# Altium schematic sheet Motors.SchDoc
size B; SheetNumber: 4; SheetTotal: 8
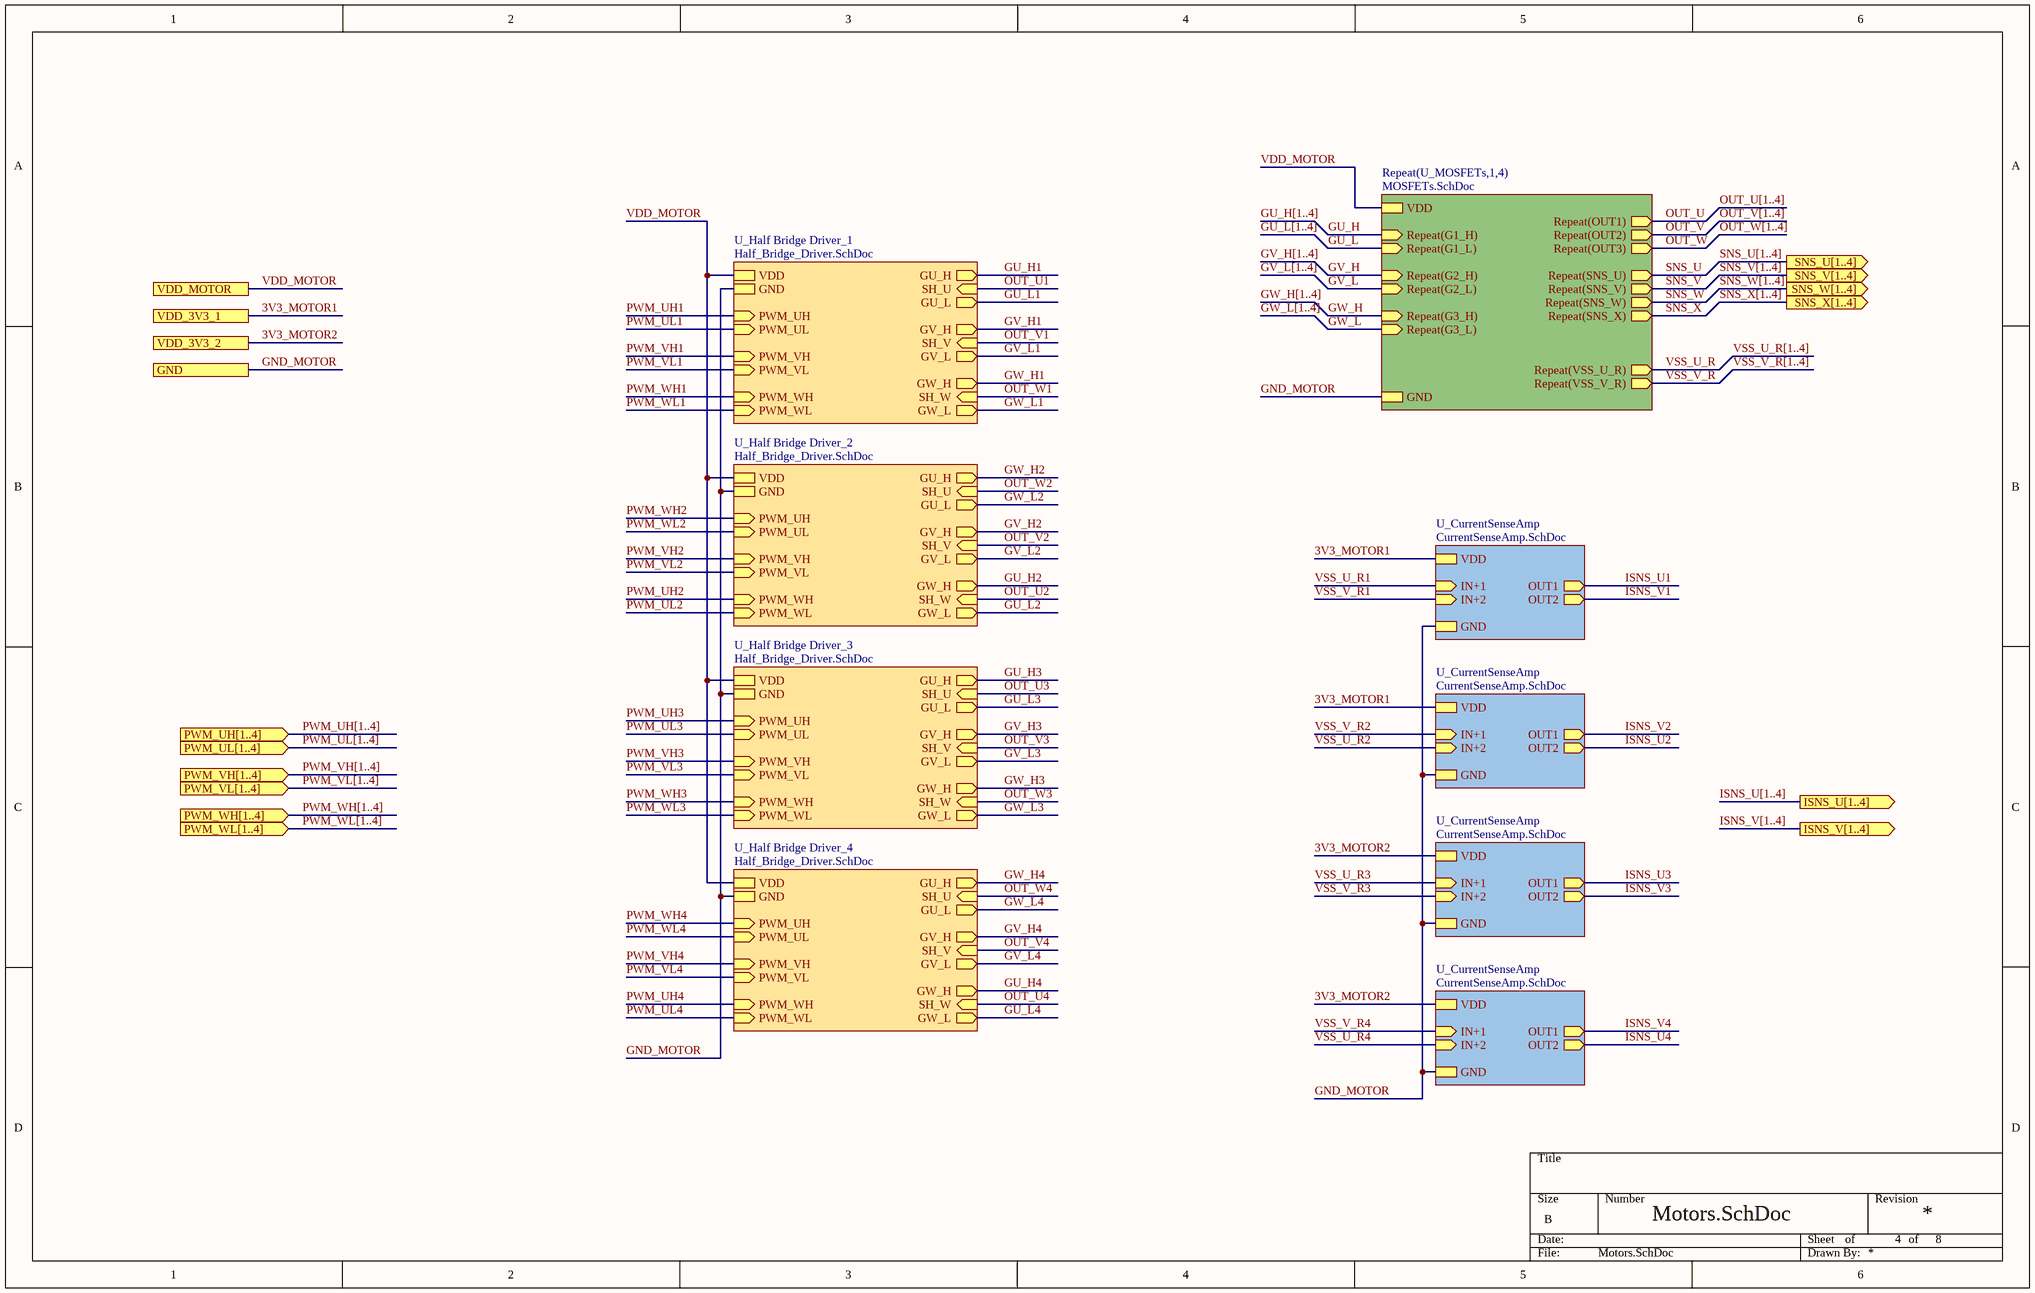
[diagram p0: Motors.SchDoc]

## Sub-sheets
Repeat(U_MOSFETs,1,4) = MOSFETs.SchDoc: Repeat(G2_H) (in), Repeat(G2_L) (in), Repeat(G1_L) (in), Repeat(G1_H) (in), Repeat(G3_H) (in), Repeat(G3_L) (in), Repeat(OUT1) (out), Repeat(OUT2) (out), Repeat(OUT3) (out), VDD, GND, Repeat(SNS_U) (out), Repeat(SNS_V) (out), Repeat(SNS_W) (out), Repeat(SNS_X) (out), Repeat(VSS_U_R) (out), Repeat(VSS_V_R) (out)
U_CurrentSenseAmp = CurrentSenseAmp.SchDoc: VDD, GND, IN+1 (in), IN+2 (in), OUT1 (out), OUT2 (out)
U_CurrentSenseAmp = CurrentSenseAmp.SchDoc: VDD, GND, IN+1 (in), IN+2 (in), OUT1 (out), OUT2 (out)
U_CurrentSenseAmp = CurrentSenseAmp.SchDoc: VDD, GND, IN+1 (in), IN+2 (in), OUT1 (out), OUT2 (out)
U_CurrentSenseAmp = CurrentSenseAmp.SchDoc: VDD, GND, IN+1 (in), IN+2 (in), OUT1 (out), OUT2 (out)
U_Half Bridge Driver_1 = Half_Bridge_Driver.SchDoc: VDD, GND, PWM_UH (in), PWM_UL (in), PWM_VH (in), PWM_VL (in), PWM_WH (in), PWM_WL (in), GU_H (out), GU_L (out), SH_U (in), GV_H (out), GV_L (out), SH_V (in), GW_H (out), GW_L (out), SH_W (in)
U_Half Bridge Driver_2 = Half_Bridge_Driver.SchDoc: VDD, GND, PWM_UH (in), PWM_UL (in), PWM_VH (in), PWM_VL (in), PWM_WH (in), PWM_WL (in), GU_H (out), GU_L (out), SH_U (in), GV_H (out), GV_L (out), SH_V (in), GW_H (out), GW_L (out), SH_W (in)
U_Half Bridge Driver_3 = Half_Bridge_Driver.SchDoc: VDD, GND, PWM_UH (in), PWM_UL (in), PWM_VH (in), PWM_VL (in), PWM_WH (in), PWM_WL (in), GU_H (out), GU_L (out), SH_U (in), GV_H (out), GV_L (out), SH_V (in), GW_H (out), GW_L (out), SH_W (in)
U_Half Bridge Driver_4 = Half_Bridge_Driver.SchDoc: VDD, GND, PWM_UH (in), PWM_UL (in), PWM_VH (in), PWM_VL (in), PWM_WH (in), PWM_WL (in), GU_H (out), GU_L (out), SH_U (in), GV_H (out), GV_L (out), SH_V (in), GW_H (out), GW_L (out), SH_W (in)

## Ports
GND, ISNS_U[1..4] (out), ISNS_V[1..4] (out), PWM_UH[1..4] (in), PWM_UL[1..4] (in), PWM_VH[1..4] (in), PWM_VL[1..4] (in), PWM_WH[1..4] (in), PWM_WL[1..4] (in), SNS_U[1..4] (out), SNS_V[1..4] (out), SNS_W[1..4] (out), SNS_X[1..4] (out), VDD_3V3_1, VDD_3V3_2, VDD_MOTOR

## Nets
3V3_MOTOR1: port VDD_3V3_1, sheet U_CurrentSenseAmp/VDD, sheet U_CurrentSenseAmp/VDD
3V3_MOTOR2: port VDD_3V3_2, sheet U_CurrentSenseAmp/VDD, sheet U_CurrentSenseAmp/VDD
GND_MOTOR: port GND, sheet Repeat(U_MOSFETs,1,4)/GND, sheet U_Half Bridge Driver_1/GND, sheet U_Half Bridge Driver_2/GND, sheet U_Half Bridge Driver_3/GND, sheet U_Half Bridge Driver_4/GND, sheet U_CurrentSenseAmp/GND, sheet U_CurrentSenseAmp/GND, sheet U_CurrentSenseAmp/GND, sheet U_CurrentSenseAmp/GND
GU_H: sheet Repeat(U_MOSFETs,1,4)/Repeat(G1_H)
GU_H1: sheet U_Half Bridge Driver_1/GU_H
GU_H2: sheet U_Half Bridge Driver_2/GW_H
GU_H3: sheet U_Half Bridge Driver_3/GU_H
GU_H4: sheet U_Half Bridge Driver_4/GW_H
GU_L: sheet Repeat(U_MOSFETs,1,4)/Repeat(G1_L)
GU_L1: sheet U_Half Bridge Driver_1/GU_L
GU_L2: sheet U_Half Bridge Driver_2/GW_L
GU_L3: sheet U_Half Bridge Driver_3/GU_L
GU_L4: sheet U_Half Bridge Driver_4/GW_L
GV_H: sheet Repeat(U_MOSFETs,1,4)/Repeat(G2_H)
GV_H1: sheet U_Half Bridge Driver_1/GV_H
GV_H2: sheet U_Half Bridge Driver_2/GV_H
GV_H3: sheet U_Half Bridge Driver_3/GV_H
GV_H4: sheet U_Half Bridge Driver_4/GV_H
GV_L: sheet Repeat(U_MOSFETs,1,4)/Repeat(G2_L)
GV_L1: sheet U_Half Bridge Driver_1/GV_L
GV_L2: sheet U_Half Bridge Driver_2/GV_L
GV_L3: sheet U_Half Bridge Driver_3/GV_L
GV_L4: sheet U_Half Bridge Driver_4/GV_L
GW_H: sheet Repeat(U_MOSFETs,1,4)/Repeat(G3_H)
GW_H1: sheet U_Half Bridge Driver_1/GW_H
GW_H2: sheet U_Half Bridge Driver_2/GU_H
GW_H3: sheet U_Half Bridge Driver_3/GW_H
GW_H4: sheet U_Half Bridge Driver_4/GU_H
GW_L: sheet Repeat(U_MOSFETs,1,4)/Repeat(G3_L)
GW_L1: sheet U_Half Bridge Driver_1/GW_L
GW_L2: sheet U_Half Bridge Driver_2/GU_L
GW_L3: sheet U_Half Bridge Driver_3/GW_L
GW_L4: sheet U_Half Bridge Driver_4/GU_L
ISNS_U1: sheet U_CurrentSenseAmp/OUT1
ISNS_U2: sheet U_CurrentSenseAmp/OUT2
ISNS_U3: sheet U_CurrentSenseAmp/OUT1
ISNS_U4: sheet U_CurrentSenseAmp/OUT2
ISNS_V1: sheet U_CurrentSenseAmp/OUT2
ISNS_V2: sheet U_CurrentSenseAmp/OUT1
ISNS_V3: sheet U_CurrentSenseAmp/OUT2
ISNS_V4: sheet U_CurrentSenseAmp/OUT1
OUT_U: sheet Repeat(U_MOSFETs,1,4)/Repeat(OUT1)
OUT_U1: sheet U_Half Bridge Driver_1/SH_U
OUT_U2: sheet U_Half Bridge Driver_2/SH_W
OUT_U3: sheet U_Half Bridge Driver_3/SH_U
OUT_U4: sheet U_Half Bridge Driver_4/SH_W
OUT_V: sheet Repeat(U_MOSFETs,1,4)/Repeat(OUT2)
OUT_V1: sheet U_Half Bridge Driver_1/SH_V
OUT_V2: sheet U_Half Bridge Driver_2/SH_V
OUT_V3: sheet U_Half Bridge Driver_3/SH_V
OUT_V4: sheet U_Half Bridge Driver_4/SH_V
OUT_W: sheet Repeat(U_MOSFETs,1,4)/Repeat(OUT3)
OUT_W1: sheet U_Half Bridge Driver_1/SH_W
OUT_W2: sheet U_Half Bridge Driver_2/SH_U
OUT_W3: sheet U_Half Bridge Driver_3/SH_W
OUT_W4: sheet U_Half Bridge Driver_4/SH_U
PWM_UH1: sheet U_Half Bridge Driver_1/PWM_UH
PWM_UH2: sheet U_Half Bridge Driver_2/PWM_WH
PWM_UH3: sheet U_Half Bridge Driver_3/PWM_UH
PWM_UH4: sheet U_Half Bridge Driver_4/PWM_WH
PWM_UL1: sheet U_Half Bridge Driver_1/PWM_UL
PWM_UL2: sheet U_Half Bridge Driver_2/PWM_WL
PWM_UL3: sheet U_Half Bridge Driver_3/PWM_UL
PWM_UL4: sheet U_Half Bridge Driver_4/PWM_WL
PWM_VH1: sheet U_Half Bridge Driver_1/PWM_VH
PWM_VH2: sheet U_Half Bridge Driver_2/PWM_VH
PWM_VH3: sheet U_Half Bridge Driver_3/PWM_VH
PWM_VH4: sheet U_Half Bridge Driver_4/PWM_VH
PWM_VL1: sheet U_Half Bridge Driver_1/PWM_VL
PWM_VL2: sheet U_Half Bridge Driver_2/PWM_VL
PWM_VL3: sheet U_Half Bridge Driver_3/PWM_VL
PWM_VL4: sheet U_Half Bridge Driver_4/PWM_VL
PWM_WH1: sheet U_Half Bridge Driver_1/PWM_WH
PWM_WH2: sheet U_Half Bridge Driver_2/PWM_UH
PWM_WH3: sheet U_Half Bridge Driver_3/PWM_WH
PWM_WH4: sheet U_Half Bridge Driver_4/PWM_UH
PWM_WL1: sheet U_Half Bridge Driver_1/PWM_WL
PWM_WL2: sheet U_Half Bridge Driver_2/PWM_UL
PWM_WL3: sheet U_Half Bridge Driver_3/PWM_WL
PWM_WL4: sheet U_Half Bridge Driver_4/PWM_UL
SNS_U: sheet Repeat(U_MOSFETs,1,4)/Repeat(SNS_U)
SNS_V: sheet Repeat(U_MOSFETs,1,4)/Repeat(SNS_V)
SNS_W: sheet Repeat(U_MOSFETs,1,4)/Repeat(SNS_W)
SNS_X: sheet Repeat(U_MOSFETs,1,4)/Repeat(SNS_X)
VDD_MOTOR: port VDD_MOTOR, sheet Repeat(U_MOSFETs,1,4)/VDD, sheet U_Half Bridge Driver_1/VDD, sheet U_Half Bridge Driver_2/VDD, sheet U_Half Bridge Driver_3/VDD, sheet U_Half Bridge Driver_4/VDD
VSS_U_R: sheet Repeat(U_MOSFETs,1,4)/Repeat(VSS_U_R)
VSS_U_R1: sheet U_CurrentSenseAmp/IN+1
VSS_U_R2: sheet U_CurrentSenseAmp/IN+2
VSS_U_R3: sheet U_CurrentSenseAmp/IN+1
VSS_U_R4: sheet U_CurrentSenseAmp/IN+2
VSS_V_R: sheet Repeat(U_MOSFETs,1,4)/Repeat(VSS_V_R)
VSS_V_R1: sheet U_CurrentSenseAmp/IN+2
VSS_V_R2: sheet U_CurrentSenseAmp/IN+1
VSS_V_R3: sheet U_CurrentSenseAmp/IN+2
VSS_V_R4: sheet U_CurrentSenseAmp/IN+1

## Buses and harness runs
bus GU_H[1..4]
bus GU_L[1..4]
bus GV_H[1..4]
bus GV_L[1..4]
bus GW_H[1..4]
bus GW_L[1..4]
bus ISNS_U[1..4] = port ISNS_U[1..4]
bus ISNS_V[1..4] = port ISNS_V[1..4]
bus OUT_U[1..4]
bus OUT_V[1..4]
bus OUT_W[1..4]
bus PWM_UH[1..4] = port PWM_UH[1..4]
bus PWM_UL[1..4] = port PWM_UL[1..4]
bus PWM_VH[1..4] = port PWM_VH[1..4]
bus PWM_VL[1..4] = port PWM_VL[1..4]
bus PWM_WH[1..4] = port PWM_WH[1..4]
bus PWM_WL[1..4] = port PWM_WL[1..4]
bus SNS_U[1..4] = port SNS_U[1..4]
bus SNS_V[1..4] = port SNS_V[1..4]
bus SNS_W[1..4] = port SNS_W[1..4]
bus SNS_X[1..4] = port SNS_X[1..4]
bus VSS_U_R[1..4]
bus VSS_V_R[1..4]

## Notes on the sheet
- of